# Altium project PowerModule.PrjPCB
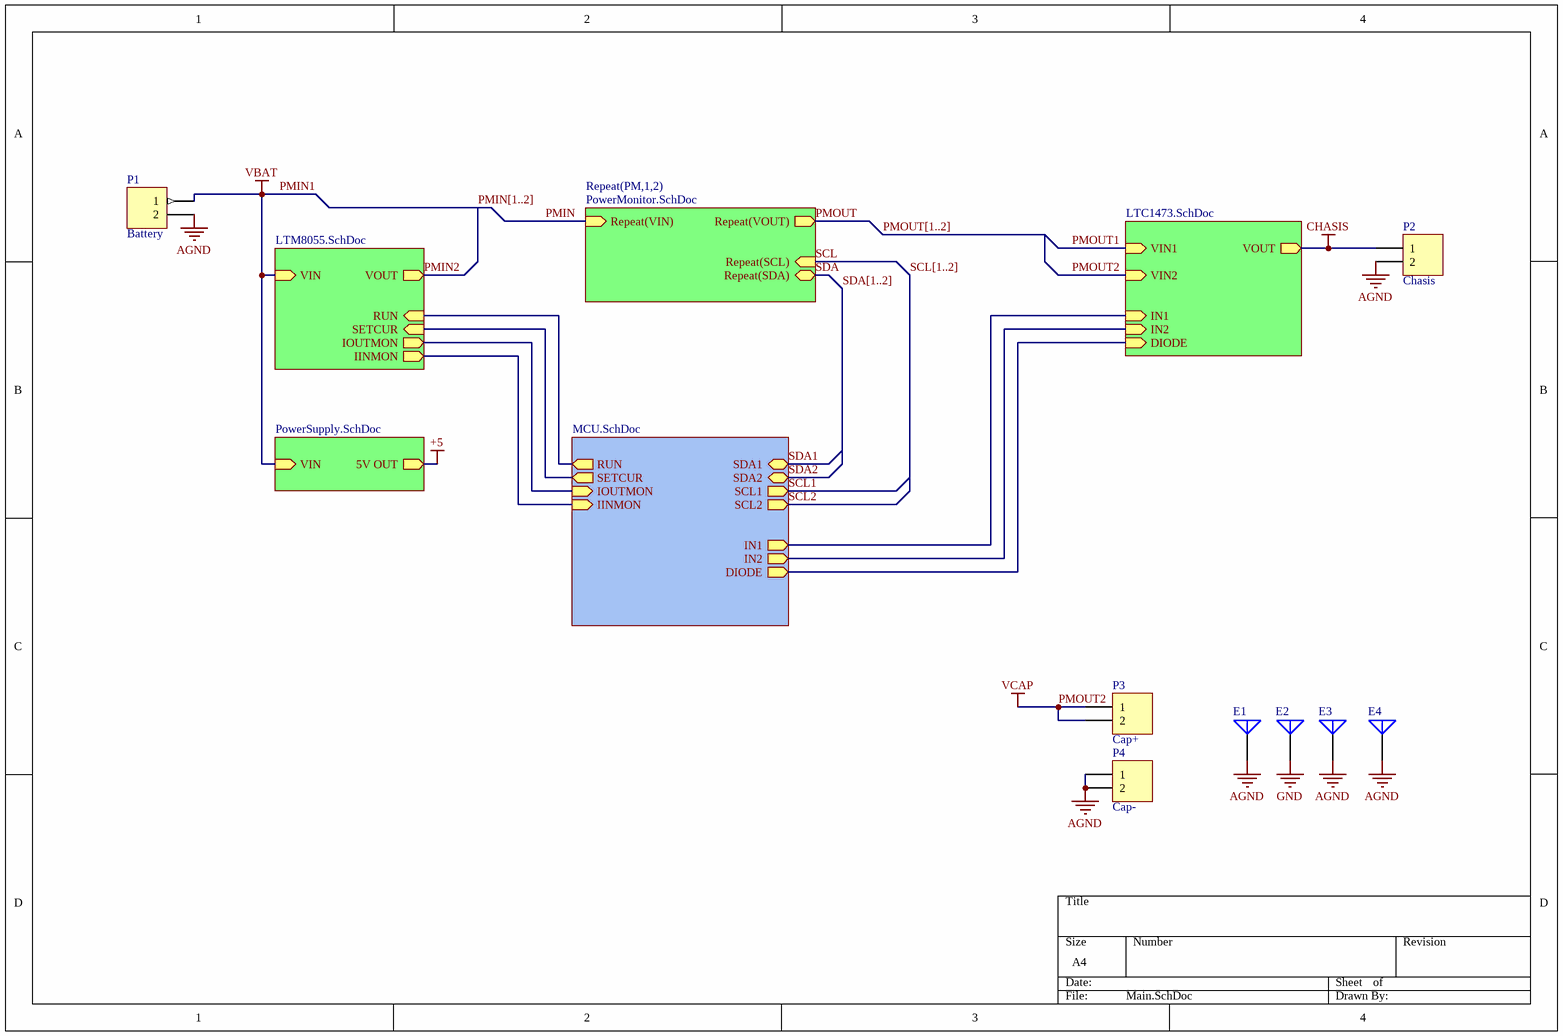
[diagram p0: Main.SchDoc]
6 sheets, 111 parts. Net scope: hierarchical (ports join the sheet entries above them; power ports are global).
Board file: SCModule2.PcbDoc
Sheets:
  Main.SchDoc
    LTM8055 = LTM8055.SchDoc
    MCU = MCU.SchDoc
    PowerSupply = PowerSupply.SchDoc
    LTC1473 = LTC1473.SchDoc
    PM1 = PowerMonitor.SchDoc
    PM2 = PowerMonitor.SchDoc

## Sheet Main.SchDoc
size A4

### Parts
E1  螺丝孔  [M3x4_N]  (value not drawn)
E2  螺丝孔  [M3x4_N]  (value not drawn)
E3  螺丝孔  [M3x4_N]  (value not drawn)
E4  螺丝孔  [M3x4_N]  (value not drawn)
P1  Battery  [TX60PW-M20]
P2  Chasis  [TX60PW-F20]
P3  Cap+  [XT30PW-F]
P4  Cap-  [XT30U-M]

### Sub-sheets
LTC1473 = LTC1473.SchDoc: VIN1 (in), VOUT (out), VIN2 (in), IN2 (in), DIODE (in), IN1 (in)
LTM8055 = LTM8055.SchDoc: VIN (in), VOUT (out), IOUTMON (out), IINMON (out), RUN (in), SETCUR (in)
MCU = MCU.SchDoc: RUN (out), SETCUR (out), IOUTMON (in), IINMON (in), SDA1 (bidir), SDA2 (bidir), SCL1 (out), SCL2 (out), IN1 (out), IN2 (out), DIODE (out)
PowerSupply = PowerSupply.SchDoc: VIN (in), 5V OUT (out)
Repeat(PM,1,2) = PowerMonitor.SchDoc: Repeat(VIN) (in), Repeat(VOUT) (out), Repeat(SCL) (in), Repeat(SDA) (bidir)

### Nets
AGND: E1.1(A) E3.1(A) E4.1(A) P1.2 P2.2 P4.1 P4.2
CHASIS: P2.1 ; sheet LTC1473/VOUT
GND: E2.1(A)
PMIN1: P1.1 ; sheet LTM8055/VIN, sheet PowerSupply/VIN, sheet LTC1473/VIN1  [also labelled PMOUT1, VBAT]  [project net *VIN]
PMOUT2: P3.1 P3.2 ; sheet LTC1473/VIN2  [also labelled VCAP]
PA3: sheet LTM8055/RUN, sheet MCU/RUN
PA4: sheet LTM8055/SETCUR, sheet MCU/SETCUR
PC1: sheet LTM8055/IOUTMON, sheet MCU/IOUTMON
PC2: sheet LTM8055/IINMON, sheet MCU/IINMON
PC10: sheet MCU/IN1, sheet LTC1473/IN1
PC11: sheet MCU/IN2, sheet LTC1473/IN2
PC12: sheet MCU/DIODE, sheet LTC1473/DIODE
PMIN: sheet Repeat(PM,1,2)/Repeat(VIN)
PMOUT: sheet Repeat(PM,1,2)/Repeat(VOUT)
SCL: sheet Repeat(PM,1,2)/Repeat(SCL)
SCL1: sheet MCU/SCL1, sheet MCU/SCL2  [also labelled SCL2]  [project net PB6]
SDA: sheet Repeat(PM,1,2)/Repeat(SDA)
SDA1: sheet MCU/SDA1, sheet MCU/SDA2  [also labelled SDA2]  [project net PB7]

### Buses and harness runs
bus PMIN[1..2]
bus PMOUT[1..2]
bus SCL[1..2]
bus SDA[1..2]

### Library data of the parts
E1-E4 = Antenna: M3螺丝孔; Published: 24-Mar-1999; LatestRevisionDate: 17-Jul-2002; LatestRevisionNote: Re-released for DXP Platform.; PackageReference: PIN1; Publisher: Altium Limited
P1-P4 = Header 2: XT电源接口; LatestRevisionDate: 17-Jul-2002; LatestRevisionNote: Re-released for DXP Platform.; Publisher: Altium Limited

## Sheet LTM8055.SchDoc
size A4
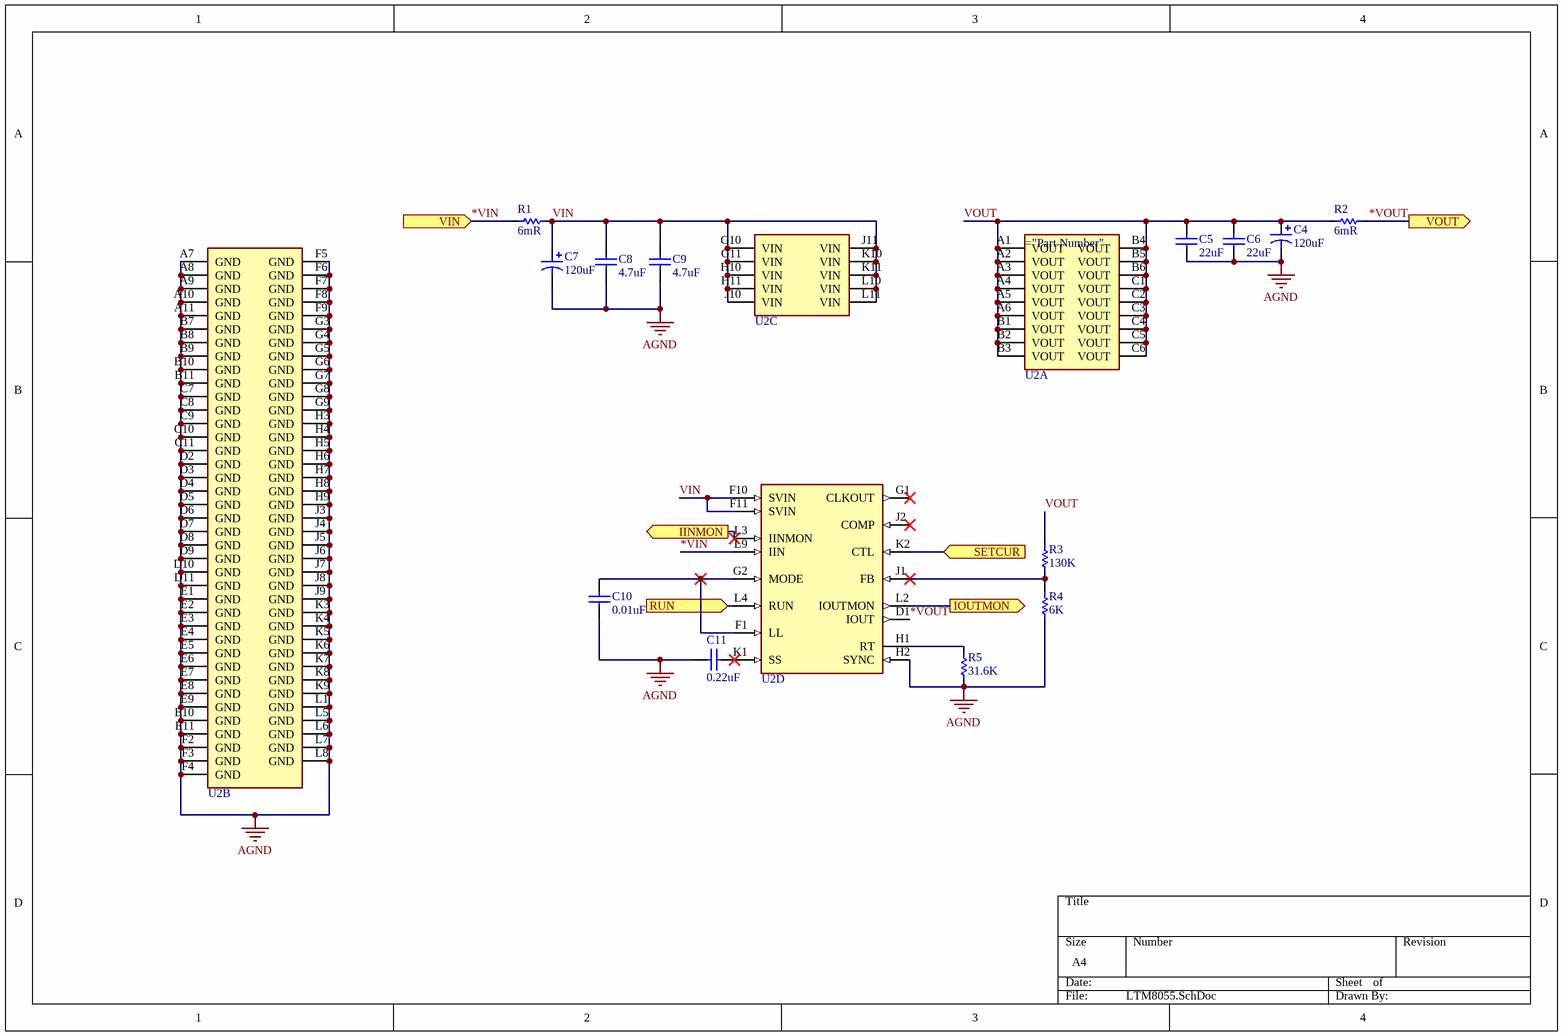
[diagram p1: LTM8055.SchDoc]

### Parts
C4  value 120uF  [CS 5.0*10*13 - C]  (hidden comment: Cap Pol1)
C5  value 22uF  [1210C]  (hidden comment: Cap)
C6  value 22uF  [1210C]  (hidden comment: Cap)
C7  value 120uF  [CS 5.0*10*13 - C]  (hidden comment: Cap Pol1)
C8  value 4.7uF  [1206C]  (hidden comment: Cap)
C9  value 4.7uF  [1206C]  (hidden comment: Cap)
C10  value 0.01uF  [0603C]  (hidden comment: Cap)
C11  value 0.22uF  [0603C]  (hidden comment: Cap)
R1  value 6mR  [R 2512_L]  (hidden comment: Res1)
R2  value 6mR  [R 2512_L]  (hidden comment: Res1)
R3  value 130K  [R 0603_L]  (hidden comment: Res1)
R4  value 6K  [R 0603_L]  (hidden comment: Res1)
R5  value 31.6K  [R 0603_L]  (hidden comment: Res1)
U2  LTM8055MPY#PBF  [DWG# 05-08-1891]  (value not drawn)  (parts A,B,C,D of 4)

### Ports
IINMON (out), IOUTMON (out), RUN (in), SETCUR (in), VIN (in), VOUT (out)

### Nets
*VIN: R1.2 U2.L9(IIN) ; port VIN
AGND: C4.2 C5.1 C6.1 C7.2 C8.1 C9.1 C10.1 C11.2 R4.2 R5.2 U2.A7(GND) U2.A8(GND) U2.A9(GND) U2.A10(GND) U2.A11(GND) U2.B7(GND) U2.B8(GND) U2.B9(GND) U2.B10(GND) U2.B11(GND) U2.C7(GND) U2.C8(GND) U2.C9(GND) U2.C10(GND) U2.C11(GND) U2.D2(GND) U2.D3(GND) U2.D4(GND) U2.D5(GND) U2.D6(GND) U2.D7(GND) U2.D8(GND) U2.D9(GND) U2.D10(GND) U2.D11(GND) U2.E1(GND) U2.E2(GND) U2.E3(GND) U2.E4(GND) U2.E5(GND) U2.E6(GND) U2.E7(GND) U2.E8(GND) U2.E9(GND) U2.E10(GND) U2.E11(GND) U2.F2(GND) U2.F3(GND) U2.F4(GND) U2.F5(GND) U2.F6(GND) U2.F7(GND) U2.F8(GND) U2.F9(GND) U2.G3(GND) U2.G4(GND) U2.G5(GND) U2.G6(GND) U2.G7(GND) U2.G8(GND) U2.G9(GND) U2.H2(SYNC) U2.H3(GND) U2.H4(GND) U2.H5(GND) U2.H6(GND) U2.H7(GND) U2.H8(GND) U2.H9(GND) U2.J3(GND) U2.J4(GND) U2.J5(GND) U2.J6(GND) U2.J7(GND) U2.J8(GND) U2.J9(GND) U2.K3(GND) U2.K4(GND) U2.K5(GND) U2.K6(GND) U2.K7(GND) U2.K8(GND) U2.K9(GND) U2.L1(GND) U2.L5(GND) U2.L6(GND) U2.L7(GND) U2.L8(GND)
*VOUT: R2.1 U2.D1(IOUT) ; port VOUT
PA3: U2.L4(RUN) ; port RUN
PA4: U2.K2(CTL) ; port SETCUR
PC1: U2.L2(IOUTMON) ; port IOUTMON
PC2: U2.L3(IINMON) ; port IINMON
VIN: C7.1 C8.2 C9.2 R1.1 U2.F10(SVIN) U2.F11(SVIN) U2.G10(VIN) U2.G11(VIN) U2.H10(VIN) U2.H11(VIN) U2.J10(VIN) U2.J11(VIN) U2.K10(VIN) U2.K11(VIN) U2.L10(VIN) U2.L11(VIN)
VOUT: C4.1 C5.2 C6.2 R2.2 R3.1 U2.A1(VOUT) U2.A2(VOUT) U2.A3(VOUT) U2.A4(VOUT) U2.A5(VOUT) U2.A6(VOUT) U2.B1(VOUT) U2.B2(VOUT) U2.B3(VOUT) U2.B4(VOUT) U2.B5(VOUT) U2.B6(VOUT) U2.C1(VOUT) U2.C2(VOUT) U2.C3(VOUT) U2.C4(VOUT) U2.C5(VOUT) U2.C6(VOUT)
NetC10_2: C10.2 U2.F1(LL) U2.G2(MODE)
NetC11_1: C11.1 U2.K1(SS)
NetR3_2: R3.2 R4.1 U2.J1(FB)
NetR5_1: R5.1 U2.H1(RT)

Not connected (* = marked no-connect by the designer): U2 G1(CLKOUT)* J2(COMP)*

### Library data of the parts
C4 C7 = Cap Pol1: Polarized Capacitor (Radial); Published: 8-Jun-2000; LatestRevisionDate: 17-Jul-2002; LatestRevisionNote: Re-released for DXP Platform.; PackageReference: RB7.6-15; Publisher: Altium Limited; PackageDescription: Polarized Capacitor (Radial); 2 Leads
C5 C6 C8-C11 = Cap: X5R 50V; Published: 8-Jun-2000; LatestRevisionDate: 17-Jul-2002; LatestRevisionNote: Re-released for DXP Platform.; PackageReference: RAD-0.3; Publisher: Altium Limited; PackageDescription: Radial Cap, Thru-Hole; 2 Leads; 0.3 in Pin Spacing
R1-R5 = Res1: Resistor; Published: 8-Jun-2000; LatestRevisionDate: 17-Jul-2002; LatestRevisionNote: Re-released for DXP Platform.; PackageReference: AXIAL-0.3; Publisher: Altium Limited; PackageDescription: Axial Device, Thru-Hole; 2 Leads; 0.3 in Pin Spacing

## Sheet MCU.SchDoc
size A4
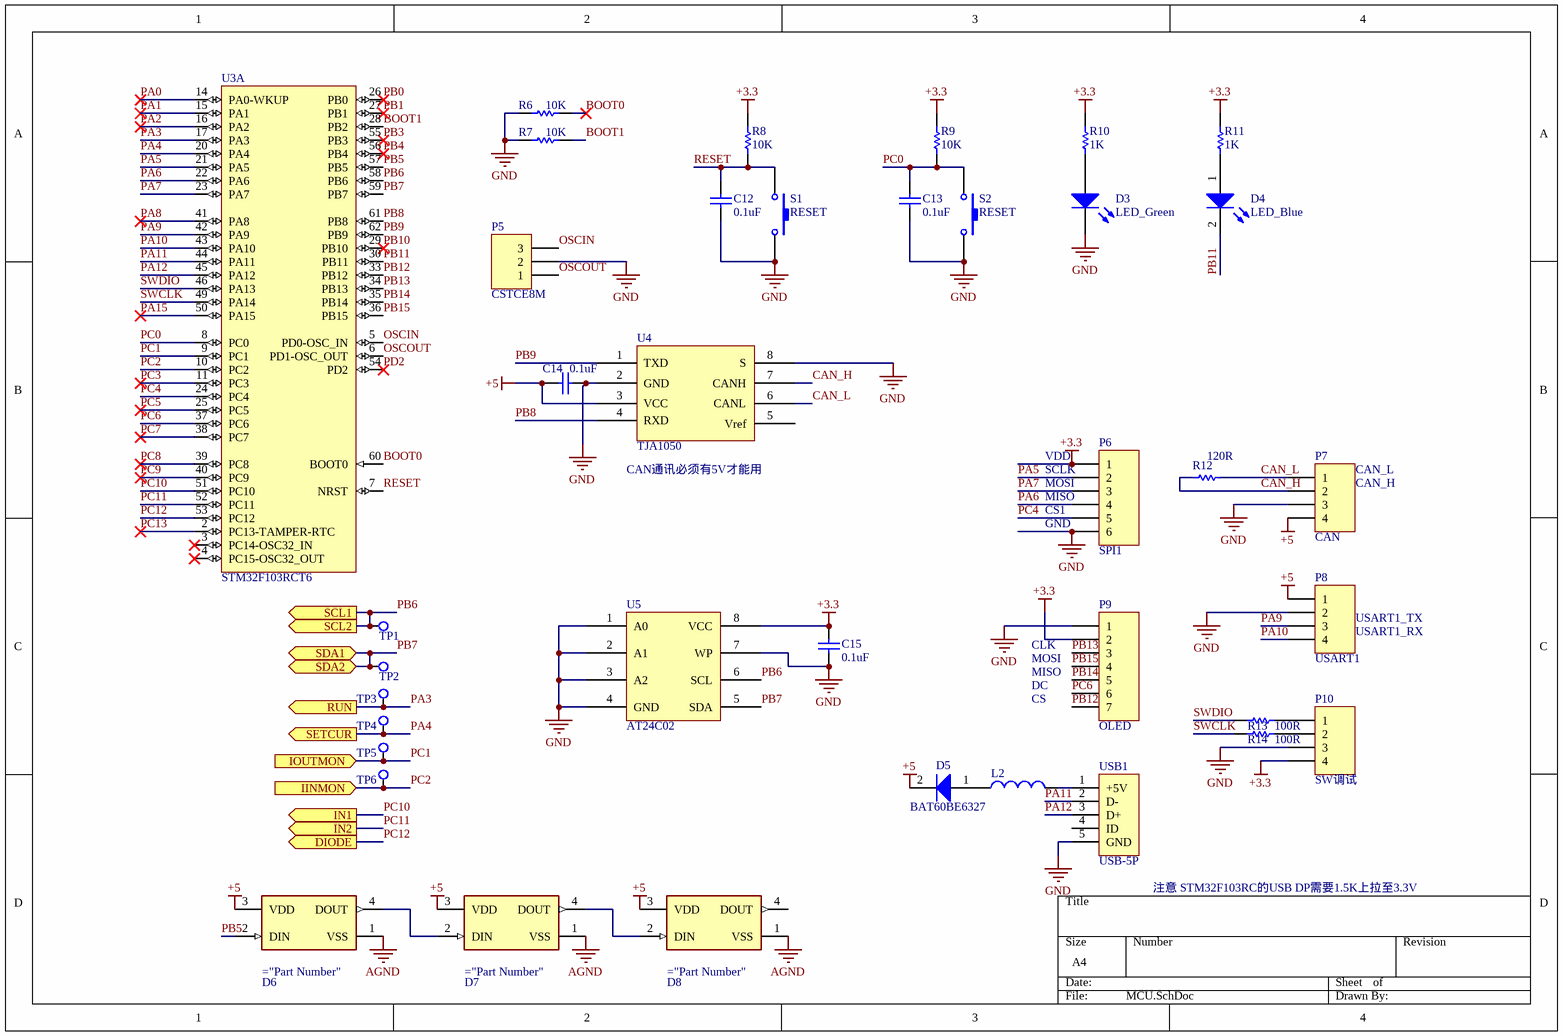
[diagram p2: MCU.SchDoc]

### Parts
C12  value 0.1uF  [0603C]  (hidden comment: Cap)
C13  value 0.1uF  [0603C]  (hidden comment: Cap)
C14  value 0.1uF  [0603C]  (hidden comment: Cap)
C15  value 0.1uF  [0603C]  (hidden comment: Cap)
D3  LED_Green  [LED 0603B]
D4  LED_Blue  [LED 0603B]
D5  BAT60BE6327  [SOD-523]
D6  WS2812  [Adafruit_1655_0]  (value not drawn)
D7  WS2812  [Adafruit_1655_0]  (value not drawn)
D8  WS2812  [Adafruit_1655_0]  (value not drawn)
L2  Inductor  [L 0603]  (value not drawn)
P5  CSTCE8M  [CSTCE16M]
P6  SPI1  [MX 1.25-WS-6P]
P7  CAN  [SM04B]
P8  USART1  [SM04B]
P9  OLED  [HDR2.54-M-LI-7P]
P10  SW调试  [53261]
R6  value 10K  [0603R]  (hidden comment: Res1)
R7  value 10K  [0603R]  (hidden comment: Res1)
R8  value 10K  [0603R]  (hidden comment: Res1)
R9  value 10K  [0603R]  (hidden comment: Res1)
R10  value 1K  [0603R]  (hidden comment: Res1)
R11  value 1K  [0603R]  (hidden comment: Res1)
R12  value 120R  [0603R]  (hidden comment: Res1)
R13  value 100R  [0603R]  (hidden comment: Res1)
R14  value 100R  [0603R]  (hidden comment: Res1)
S1  RESET  [TSW SMD-3*6*2.5]
S2  RESET  [TSW SMD-3*6*2.5]
TP1  TestPoint  [TP_Black(1.6mm)]  (value not drawn)
TP2  TestPoint  [TP_Black(1.6mm)]  (value not drawn)
TP3  TestPoint  [TP_Black(1.6mm)]  (value not drawn)
TP4  TestPoint  [TP_Black(1.6mm)]  (value not drawn)
TP5  TestPoint  [TP_Black(1.6mm)]  (value not drawn)
TP6  TestPoint  [TP_Black(1.6mm)]  (value not drawn)
U3  STM32F103RCT6  [STM-LQFP64_N]  (part A of 2)
U4  TJA1050  [SO8]
U5  AT24C02  [SOP8]
USB1  USB-5P  [USB-MICRO_E]

### Ports
DIODE (out), IINMON (in), IN1 (out), IN2 (out), IOUTMON (in), RUN (out), SCL1 (out), SCL2 (out), SDA1 (bidir), SDA2 (bidir), SETCUR (out)

### Nets
+3.3: C15.1 P6.1 P9.2 P10.4 R8.2 R9.2 R10.2 R11.2 U5.8(VCC)
+5: C14.2 D5.2(K) D6.3(VDD) D7.3(VDD) D8.3(VDD) P7.4 P8.1 U4.3(VCC)
AGND: D6.1(VSS) D7.1(VSS) D8.1(VSS)
GND: C12.1 C13.1 C14.1 C15.2 D3.2(K) P5.2 P6.6 P7.3 P8.2 P9.1 P10.3 R6.1 R7.1 S1.2 S2.2 U4.2(GND) U4.8(S) U5.1(A0) U5.2(A1) U5.3(A2) U5.4(GND) U5.7(WP) USB1.5(GND)
BOOT0: R6.2 U3.60(BOOT0)
BOOT1: R7.2 U3.28(PB2)
CAN_H: P7.2 R12.1 U4.7(CANH)
CAN_L: P7.1 R12.2 U4.6(CANL)
OSCIN: P5.3 U3.5(PD0-OSC_IN)
OSCOUT: P5.1 U3.6(PD1-OSC_OUT)
PA0: U3.14(PA0-WKUP)
PA1: U3.15(PA1)
PA2: U3.16(PA2)
PA3: TP3.1(VSS) U3.17(PA3) ; port RUN
PA4: TP4.1(VSS) U3.20(PA4) ; port SETCUR
PA5: P6.2 U3.21(PA5)
PA6: P6.4 U3.22(PA6)
PA7: P6.3 U3.23(PA7)
PA8: U3.41(PA8)
PA9: P8.3 U3.42(PA9)
PA10: P8.4 U3.43(PA10)
PA11: U3.44(PA11) USB1.2(D-)
PA12: U3.45(PA12) USB1.3(D+)
PA15: U3.50(PA15)
PB0: U3.26(PB0)
PB1: U3.27(PB1)
PB3: U3.55(PB3)
PB4: U3.56(PB4)
PB5: D6.2(DIN) U3.57(PB5)
PB6: TP1.1(VSS) U3.58(PB6) U5.6(SCL) ; port SCL2, port SCL1
PB7: TP2.1(VSS) U3.59(PB7) U5.5(SDA) ; port SDA1, port SDA2
PB8: U3.61(PB8) U4.4(RXD)
PB9: U3.62(PB9) U4.1(TXD)
PB10: U3.29(PB10)
PB11: D4.2(K) U3.30(PB11)
PB12: P9.7 U3.33(PB12)
PB13: P9.3 U3.34(PB13)
PB14: P9.5 U3.35(PB14)
PB15: P9.4 U3.36(PB15)
PC0: C13.2 R9.1 S2.1 U3.8(PC0)
PC1: TP5.1(VSS) U3.9(PC1) ; port IOUTMON
PC2: TP6.1(VSS) U3.10(PC2) ; port IINMON
PC3: U3.11(PC3)
PC4: P6.5 U3.24(PC4)
PC5: U3.25(PC5)
PC6: P9.6 U3.37(PC6)
PC7: U3.38(PC7)
PC8: U3.39(PC8)
PC9: U3.40(PC9)
PC10: U3.51(PC10) ; port IN1
PC11: U3.52(PC11) ; port IN2
PC12: U3.53(PC12) ; port DIODE
PC13: U3.2(PC13-TAMPER-RTC)
PD2: U3.54(PD2)
RESET: C12.2 R8.1 S1.1 U3.7(NRST)
SWCLK: R14.1 U3.49(PA14)
SWDIO: R13.1 U3.46(PA13)
NetD3_1: D3.1(A) R10.1
NetD4_1: D4.1(A) R11.1
NetD5_1: D5.1(A) L2.1
NetD6_4: D6.4(DOUT) D7.2(DIN)
NetD7_4: D7.4(DOUT) D8.2(DIN)
NetL2_2: L2.2 USB1.1(+5V)
NetP10_1: P10.1 R13.2
NetP10_2: P10.2 R14.2

Not connected (* = marked no-connect by the designer): D8 4(DOUT); U3 3(PC14-OSC32_IN)* 4(PC15-OSC32_OUT)*; U4 5(Vref); USB1 4(ID)

### Notes on the sheet
- (near U4) CAN通讯必须有5V才能用
- (near P6) VDD
- (near P6) SCLK
- (near P6) MOSI
- (near P6) MISO
- (near P6) CS1
- (near P7) CAN_L
- (near P7) CAN_H
- (near P6) GND
- (near P9) CLK
- (near P8) USART1_TX
- (near P8) USART1_RX
- CS
- DC
- (near P9) MISO
- (near P9) MOSI
- 注意 STM32F103RC的USB DP需要1.5K上拉至3.3V

### Library data of the parts
C12-C15 = Cap: X5R 50V; Published: 8-Jun-2000; LatestRevisionDate: 17-Jul-2002; LatestRevisionNote: Re-released for DXP Platform.; PackageReference: RAD-0.3; Publisher: Altium Limited; PackageDescription: Radial Cap, Thru-Hole; 2 Leads; 0.3 in Pin Spacing
D3 = LED0: Green; Published: 8-Jun-2000; LatestRevisionDate: 08-Jul-2005; LatestRevisionNote: Mech Layer 1 removed.; PackageReference: LED-0; Publisher: Altium Limited; PackageDescription: LED; 2 Leads
D4 = LED0: Blue; Published: 8-Jun-2000; LatestRevisionDate: 08-Jul-2005; LatestRevisionNote: Mech Layer 1 removed.; PackageReference: LED-0; Publisher: Altium Limited; PackageDescription: LED; 2 Leads
D5 = Diode: Published: 8-Jun-2000; LatestRevisionDate: 17-Jul-2002; LatestRevisionNote: Re-released for DXP Platform.; PackageVersion: Sep-1996; PackageReference: SMC; Publisher: Altium Limited; PackageDescription: DO-214-AB/SMC; 2 C-Bend Leads; Body 7.9 x 5.9 mm, inc. leads (LxW); Code_JEDEC: DO-214-AB
D6-D8 = WS2812: RGB LED
L2 = Inductor: MPZ1608S181ATAH0; Code_IEC: 1005; Value: mH; Published: 8-Jun-2000; LatestRevisionDate: 29-May-2009; LatestRevisionNote: IPC-7351 Footprint Added.; PackageReference: 0402-A; Publisher: Altium Limited; PackageDescription: Chip Inductor; Code_JEITA: 0402
P5 = Header 3: Header, 3-Pin; LatestRevisionDate: 17-Jul-2002; LatestRevisionNote: Re-released for DXP Platform.; Publisher: Altium Limited
P6 = Header 6: Header, 6-Pin; LatestRevisionDate: 17-Jul-2002; LatestRevisionNote: Re-released for DXP Platform.; Publisher: Altium Limited
P7 P8 = Header 4: Header, 4-Pin; LatestRevisionDate: 17-Jul-2002; LatestRevisionNote: Re-released for DXP Platform.; Publisher: Altium Limited
P9 = Header 7: OLED Connector 7P杜邦母头; LatestRevisionDate: 17-Jul-2002; LatestRevisionNote: Re-released for DXP Platform.; Publisher: Altium Limited
P10 = Header 4: Connector MX1.25 4P; LatestRevisionDate: 17-Jul-2002; LatestRevisionNote: Re-released for DXP Platform.; Publisher: Altium Limited
R6-R14 = Res1: Resistor; Published: 8-Jun-2000; LatestRevisionDate: 17-Jul-2002; LatestRevisionNote: Re-released for DXP Platform.; PackageReference: AXIAL-0.3; Publisher: Altium Limited; PackageDescription: Axial Device, Thru-Hole; 2 Leads; 0.3 in Pin Spacing
S1 S2 = SW-PB: Switch; Published: 24-Mar-1999; LatestRevisionDate: 17-Jul-2002; LatestRevisionNote: Re-released for DXP Platform.; PackageReference: SPST-2; Publisher: Altium Limited; PackageDescription: Switch; 2 Leads
TP1-TP6 = TestPoint: PCB测试点
U3 = STM32F103RCT6: ARM Cortex-M3 32-bit MCU, 256 KB Flash, 48 KB Internal RAM, 51 I/Os, 64-pin LQFP, -40 to 85 degC, Tray; A/D Converter: 3x12-bit (16 Channel); D/A Converter: 2x12-bit (2 Channel); FLASH Size (Prog) (kB): 256; I/Os (High Current): 51; Internal RAM Size (kB): 48; Operating Frequency(F) (Processor speed) (MHz): 72; Supply Voltage(Vcc) min (V): 2; DatasheetVersion: Rev. 8; PackageVersion: Rev. 4, 06/2013; PackageReference: LQFP64; PackageDescription: 64-Pin Low Profile Quad Flat Package, 10 x 10 mm Body, 0.5 mm Pitch; Supplier 1: Digi-Key; Supplier Part Number 1: 497-9033-ND; Supplier 2: Newark; Supplier Part Number 2: 01P4099; Supplier 3: Newark; Supplier Part Number 3: 57P1227; Supplier 4: Mouser; Supplier Part Number 4: 511-STM32F103RCT6; Core: ARM Cortex-M3; Packing: Tray; Mounting Technology: Surface Mount; PartNumber: STM32F103RCT6; ComponentLink1Description: Manufacturer URL; ComponentLink1URL: http://www.st.com/web/en/home.html; ComponentLink2Description: Datasheet; ComponentLink2URL: http://www.st.com/st-web-ui/static/active/en/resource/technical/document/datasheet/CD00191185.pdf; ComponentLink3Description: Package Specification; ComponentLink3URL: http://www.st.com/st-web-ui/static/active/en/resource/technical/document/datasheet/DM00037051.pdf
U4 = TJA1050: CAN收发器
USB1 = USB-5P: 微型USB母座; 版权归属: 源创客; BOM名称: 微型USB母座; 学习资源: www.ooocke.com

## Sheet PowerSupply.SchDoc
size A4
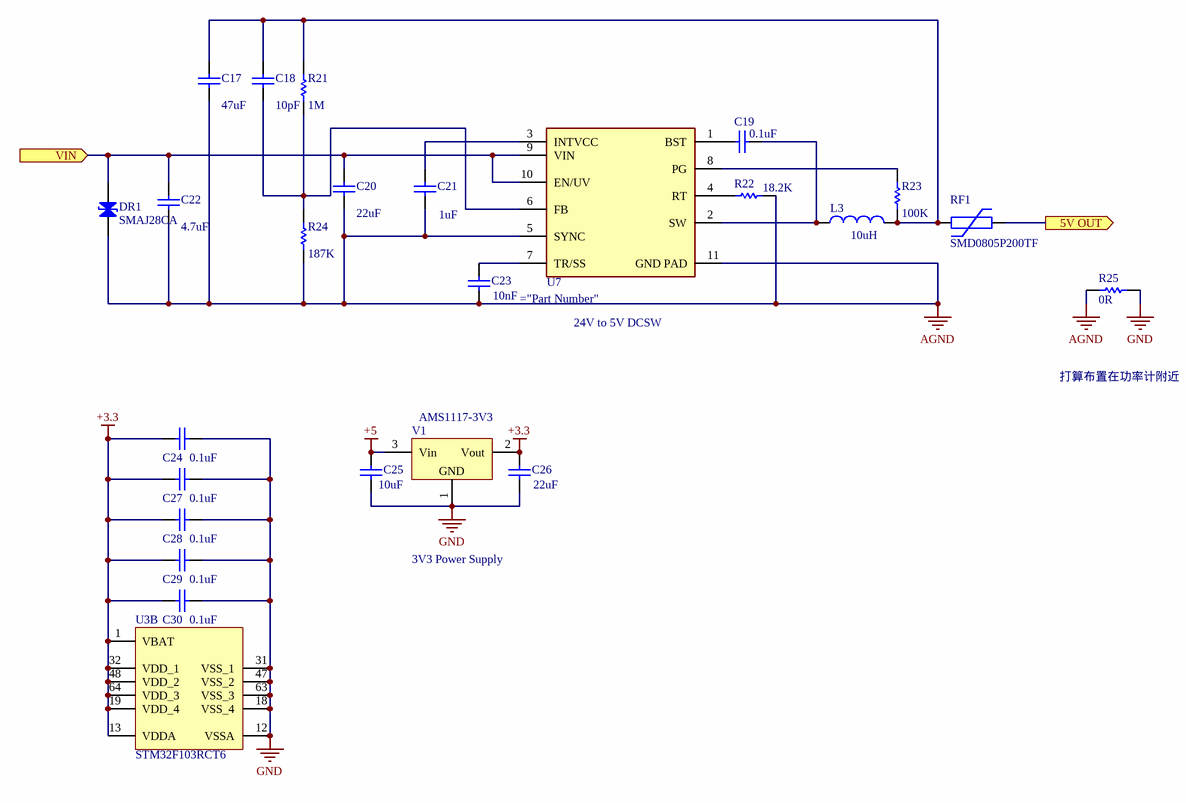
[diagram p3: PowerSupply.SchDoc]

### Parts
C17  value 47uF  [C1206]  (hidden comment: Cap)
C18  value 10pF  [C 0603_L]  (hidden comment: Cap)
C19  value 0.1uF  [C 0603_L]  (hidden comment: Cap)
C20  value 22uF  [C 1206_L]  (hidden comment: Cap)
C21  value 1uF  [C 0603_L]  (hidden comment: Cap)
C22  value 4.7uF  [C 1206_L]  (hidden comment: Cap)
C23  value 10nF  [C 0603_L]  (hidden comment: Cap)
C24  value 0.1uF  [0603C]  (hidden comment: Cap)
C25  value 10uF  [C 1206_L]  (hidden comment: Cap)
C26  value 22uF  [C 1206_L]  (hidden comment: Cap)
C27  value 0.1uF  [0603C]  (hidden comment: Cap)
C28  value 0.1uF  [0603C]  (hidden comment: Cap)
C29  value 0.1uF  [0603C]  (hidden comment: Cap)
C30  value 0.1uF  [0603C]  (hidden comment: Cap)
DR1  SMAJ28CA  [SMA]
L3  value 10uH  [XAL4040]  (hidden comment: Inductor)
R21  value 1M  [R 0603_L]  (hidden comment: Res1)
R22  value 18.2K  [R 0603_L]  (hidden comment: Res1)
R23  value 100K  [R 0603_L]  (hidden comment: Res1)
R24  value 187K  [R 0603_L]  (hidden comment: Res1)
R25  value 0R  [0805R]  (hidden comment: Res1)
RF1  SMD0805P200TF  [R 0805_L]
U3  STM32F103RCT6  [STM-LQFP64_N]  (part B of 2)
U7  LT8609EMSE#PBF  [LT8609EMS]  (value not drawn)
V1  AMS1117-3V3  [SOT223_N]

### Ports
5V OUT (out), VIN (in)

### Nets
*VIN: C20.2 C22.2 DR1.1(A) U7.9(VIN) U7.10(EN/UV) ; port VIN
+3.3: C24.1 C26.2 C27.1 C28.1 C29.1 C30.1 U3.1(VBAT) U3.13(VDDA) U3.19(VDD_4) U3.32(VDD_1) U3.48(VDD_2) U3.64(VDD_3) V1.2(Vout)
+5: C25.2 RF1.2 V1.3(Vin) ; port 5V OUT
AGND: C17.1 C20.1 C21.1 C22.1 C23.1 DR1.2(K) R22.1 R24.2 R25.2 U7.5(SYNC) U7.11(GND_PAD)
GND: C24.2 C25.1 C26.1 C27.2 C28.2 C29.2 C30.2 R25.1 U3.12(VSSA) U3.18(VSS_4) U3.31(VSS_1) U3.47(VSS_2) U3.63(VSS_3) V1.1(GND)
NetC17_2: C17.2 C18.2 L3.2 R21.1 R23.1 RF1.1
NetC18_1: C18.1 R21.2 R24.1 U7.6(FB)
NetC19_1: C19.1 L3.1 U7.2(SW)
NetC19_2: C19.2 U7.1(BST)
NetC21_2: C21.2 U7.3(INTVCC)
NetC23_2: C23.2 U7.7(TR/SS)
NetR22_2: R22.2 U7.4(RT)
NetR23_2: R23.2 U7.8(PG)

### Notes on the sheet
- 24V to 5V DCSW
- 打算布置在功率计附近
- 3V3 Power Supply

### Library data of the parts
C17 C25 C26 = Cap: X5R 25V; Published: 8-Jun-2000; LatestRevisionDate: 17-Jul-2002; LatestRevisionNote: Re-released for DXP Platform.; PackageReference: RAD-0.3; Publisher: Altium Limited; PackageDescription: Radial Cap, Thru-Hole; 2 Leads; 0.3 in Pin Spacing
C18 C23 = Cap: C0G 50V; Published: 8-Jun-2000; LatestRevisionDate: 17-Jul-2002; LatestRevisionNote: Re-released for DXP Platform.; PackageReference: RAD-0.3; Publisher: Altium Limited; PackageDescription: Radial Cap, Thru-Hole; 2 Leads; 0.3 in Pin Spacing
C19-C22 C24 C27-C30 = Cap: X5R 50V; Published: 8-Jun-2000; LatestRevisionDate: 17-Jul-2002; LatestRevisionNote: Re-released for DXP Platform.; PackageReference: RAD-0.3; Publisher: Altium Limited; PackageDescription: Radial Cap, Thru-Hole; 2 Leads; 0.3 in Pin Spacing
DR1 = DR: 瞬态电压抑制二极管; 版权归属: 源创客; BOM名称: 瞬态电压抑制二极管; 学习资源: www.ooocke.com
L3 = Inductor: XAL4040 10uH; Code_IEC: 1005; Published: 8-Jun-2000; LatestRevisionDate: 29-May-2009; LatestRevisionNote: IPC-7351 Footprint Added.; PackageReference: 0402-A; Publisher: Altium Limited; PackageDescription: Chip Inductor; Code_JEITA: 0402
R21-R25 = Res1: Resistor; Published: 8-Jun-2000; LatestRevisionDate: 17-Jul-2002; LatestRevisionNote: Re-released for DXP Platform.; PackageReference: AXIAL-0.3; Publisher: Altium Limited; PackageDescription: Axial Device, Thru-Hole; 2 Leads; 0.3 in Pin Spacing
RF1 = PPTC: PPTC自恢复保险丝; 版权归属: 源创客; BOM名称: PPTC自恢复保险丝; 学习资源: www.ooocke.com
U3 = STM32F103RCT6: as U3 on sheet MCU; DatasheetVersion: Rev. 8; PackageVersion: Rev. 4, 06/2013; PackageReference: LQFP64; PackageDescription: 64-Pin Low Profile Quad Flat Package, 10 x 10 mm Body, 0.5 mm Pitch; Supplier 1: Digi-Key; Supplier Part Number 1: 497-9033-ND; Supplier 2: Newark; Supplier Part Number 2: 01P4099; Supplier 3: Newark; Supplier Part Number 3: 57P1227; Supplier 4: Mouser; Supplier Part Number 4: 511-STM32F103RCT6; Core: ARM Cortex-M3; Packing: Tray; Mounting Technology: Surface Mount; PartNumber: STM32F103RCT6; ComponentLink1Description: Manufacturer URL; ComponentLink1URL: http://www.st.com/web/en/home.html; ComponentLink2Description: Datasheet; ComponentLink2URL: http://www.st.com/st-web-ui/static/active/en/resource/technical/document/datasheet/CD00191185.pdf; ComponentLink3Description: Package Specification; ComponentLink3URL: http://www.st.com/st-web-ui/static/active/en/resource/technical/document/datasheet/DM00037051.pdf
V1 = AMS1117: 三端稳压芯片; BOM名称: 稳压芯片; 版权归属: 源创客; 学习资源: www.ooocke.com

## Sheet LTC1473.SchDoc
size A4
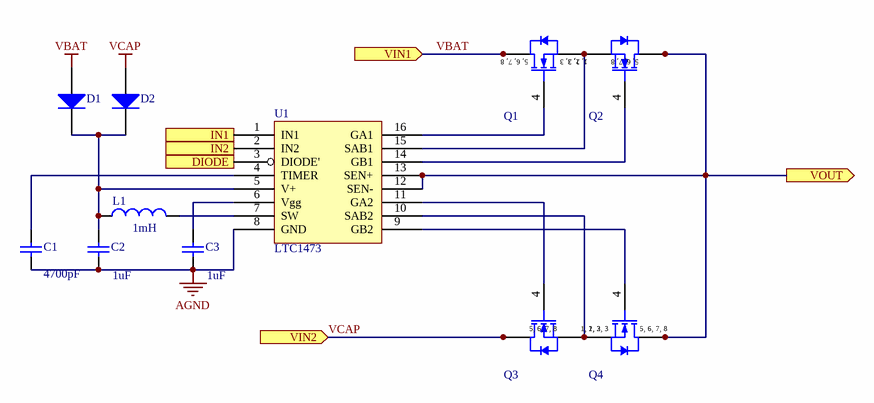
[diagram p4: LTC1473.SchDoc]

### Parts
C1  value 4700pF  [C 0603_L]  (hidden comment: Cap)
C2  value 1uF  [C 0603_L]  (hidden comment: Cap)
C3  value 1uF  [C 0603_L]  (hidden comment: Cap)
D1  Diode  [SOD-523]  (value not drawn)
D2  Diode  [SOD-523]  (value not drawn)
L1  value 1mH  [1812LS-105XKBC]  (hidden comment: Inductor)
Q1  BSC028N06NS G  [INF-PG-TDSON-8-1_V]  (value not drawn)
Q2  BSC028N06NS G  [INF-PG-TDSON-8-1_V]  (value not drawn)
Q3  BSC028N06NS G  [INF-PG-TDSON-8-1_V]  (value not drawn)
Q4  BSC028N06NS G  [INF-PG-TDSON-8-1_V]  (value not drawn)
U1  LTC1473  [SSOP16_N]

### Ports
DIODE (in), IN1 (in), IN2 (in), VIN1 (in), VIN2 (in), VOUT (out)

### Nets
AGND: C1.1 C2.1 C3.1 U1.8(GND)
CHASIS: Q2.5(DRAIN) Q2.6(DRAIN) Q2.7(DRAIN) Q2.8(DRAIN) Q4.5(DRAIN) Q4.6(DRAIN) Q4.7(DRAIN) Q4.8(DRAIN) U1.12(SEN-) U1.13(SEN+) ; port VOUT
VBAT: D1.1(A) Q1.5(DRAIN) Q1.6(DRAIN) Q1.7(DRAIN) Q1.8(DRAIN) ; port VIN1  [project net *VIN]
VCAP: D2.1(A) Q3.5(DRAIN) Q3.6(DRAIN) Q3.7(DRAIN) Q3.8(DRAIN) ; port VIN2  [project net PMOUT2]
PC10: U1.1(IN1) ; port IN1
PC11: U1.2(IN2) ; port IN2
PC12: U1.3(DIODE') ; port DIODE
NetC1_2: C1.2 U1.4(TIMER)
NetC2_2: C2.2 D1.2(K) D2.2(K) L1.1 U1.5(V+)
NetC3_2: C3.2 U1.6(Vgg)
NetL1_2: L1.2 U1.7(SW)
NetQ1_1: Q1.1(SOURCE) Q1.2(SOURCE) Q1.3(SOURCE) Q2.1(SOURCE) Q2.2(SOURCE) Q2.3(SOURCE) U1.15(SAB1)
NetQ1_4: Q1.4(GATE) U1.16(GA1)
NetQ2_4: Q2.4(GATE) U1.14(GB1)
NetQ3_1: Q3.1(SOURCE) Q3.2(SOURCE) Q3.3(SOURCE) Q4.1(SOURCE) Q4.2(SOURCE) Q4.3(SOURCE) U1.10(SAB2)
NetQ3_4: Q3.4(GATE) U1.11(GA2)
NetQ4_4: Q4.4(GATE) U1.9(GB2)

### Notes on the sheet
- (in symbol BSC118N10NS G) 5, 6, 7, 8; 1, 2, 3

### Library data of the parts
C1-C3 = Cap: X5R 50V; Published: 8-Jun-2000; LatestRevisionDate: 17-Jul-2002; LatestRevisionNote: Re-released for DXP Platform.; PackageReference: RAD-0.3; Publisher: Altium Limited; PackageDescription: Radial Cap, Thru-Hole; 2 Leads; 0.3 in Pin Spacing
D1 D2 = Diode: SS14; Published: 8-Jun-2000; LatestRevisionDate: 17-Jul-2002; LatestRevisionNote: Re-released for DXP Platform.; PackageVersion: Sep-1996; PackageReference: SMC; Publisher: Altium Limited; PackageDescription: DO-214-AB/SMC; 2 C-Bend Leads; Body 7.9 x 5.9 mm, inc. leads (LxW); Code_JEDEC: DO-214-AB
L1 = Inductor: 1812LS-105XKBC; Code_IEC: 1005; Published: 8-Jun-2000; LatestRevisionDate: 29-May-2009; LatestRevisionNote: IPC-7351 Footprint Added.; PackageReference: 0402-A; Publisher: Altium Limited; PackageDescription: Chip Inductor; Code_JEITA: 0402
Q1-Q4 = BSC118N10NS G: N-Channel OptiMOS 2 Power-Transistor, 100 V VDS, 71 A ID, -55 to 150 degC , PG-TDSON-8-1, Reel, Green; Manufacturer: Infineon; Green: TRUE; ID (max): 71 A; IDpuls (max): 280 A; Polarity: N; Ptot (max): 114 W; QG: 42 nC; RDS (on) (max): 11.8 mOhm; Rth: 1.1 K/W; RthJA (max): 62 K/W; VDS (max): 100 V; VGS(th) (max): 4 V; VGS(th) (min): 2 V; DatasheetVersion: Rev. 1.08; PackageReference: PG-TDSON-8-1; PackageDescription: 8-Pin Plastic (Green) Thin Dual Small Outline Non-Leaded Package, 5.15 x 5.9 mm Body, 1.27 mm Pitch; Supplier 1: Mouser; Supplier Part Number 1: 726-BSC118N10NSG; Supplier 2: Digi-Key; Supplier Part Number 2: BSC118N10NS G-ND; Halogen-free: TRUE; Packing: Reel; RthJC (max): 1.1 K/W; Mounting Technology: Surface Mount; PartNumber: BSC118N10NS G; ComponentLink1Description: Manufacturer URL; ComponentLink1URL: http://www.infineon.com/; ComponentLink2Description: Datasheet; ComponentLink2URL: http://www.infineon.com/dgdl/BSC118N10NS+Rev18_pdf.pdf?folderId=db3a3043156fd5730115c7d50620107c&fileId=db3a3043163797a6011647fdc2d4071c; ComponentLink3Description: Package Specification; ComponentLink3URL: http://www.infineon.com/cms/packages/SMD_-_Surface_Mounted_Devices/P-PG-TDSON/P-PG-TDSON-08-01x_2x_3.html?__locale=en

## Sheet PowerMonitor.SchDoc
size A4
Used 2 times, as channels PM1, PM2. Parts and nets are listed once, with the designators drawn on the sheet.
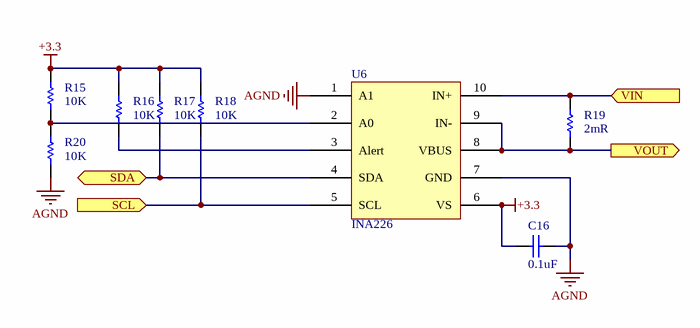
[diagram p5: PowerMonitor.SchDoc]

### Parts
C16  value 0.1uF  [C 0603_L]  (hidden comment: Cap)
R15  value 10K  [R 0603_L]  (hidden comment: Res1)
R16  value 10K  [R 0603_L]  (hidden comment: Res1)
R17  value 10K  [R 0603_L]  (hidden comment: Res1)
R18  value 10K  [R 0603_L]  (hidden comment: Res1)
R19  value 2mR  [R 2512_L]  (hidden comment: Res1)
R20  value 10K  [R 0603_L]  (hidden comment: Res1)
U6  INA226  [MSOP10_N]

### Ports
SCL (in), SDA (bidir), VIN (in), VOUT (out)

### Nets
+3.3: C16.1 R15.2 R16.2 R17.2 R18.2 U6.6(VS)
AGND: C16.2 R20.1 U6.1(A1) U6.7(GND)
SCL: R18.1 U6.5(SCL) ; port SCL
SDA: R17.1 U6.4(SDA) ; port SDA
VIN: R19.2 U6.10(IN+) ; port VIN
VOUT: R19.1 U6.8(VBUS) U6.9(IN-) ; port VOUT
NetR15_1: R15.1 R20.2 U6.2(A0)
NetR16_1: R16.1 U6.3(Alert)

### Channels
PM1: designators end in A; ports SCL=PB6 SDA=PB7 VIN=*VIN VOUT=*VIN
PM2: designators end in B; ports SCL=PB6 SDA=PB7 VIN=*VOUT VOUT=PMOUT2

### Library data of the parts
C16 = Cap: X5R 50V; Published: 8-Jun-2000; LatestRevisionDate: 17-Jul-2002; LatestRevisionNote: Re-released for DXP Platform.; PackageReference: RAD-0.3; Publisher: Altium Limited; PackageDescription: Radial Cap, Thru-Hole; 2 Leads; 0.3 in Pin Spacing
R15-R20 = Res1: Resistor; Published: 8-Jun-2000; LatestRevisionDate: 17-Jul-2002; LatestRevisionNote: Re-released for DXP Platform.; PackageReference: AXIAL-0.3; Publisher: Altium Limited; PackageDescription: Axial Device, Thru-Hole; 2 Leads; 0.3 in Pin Spacing

## Nets that join several sheets
*VIN: Main (P1.1), LTM8055 (R1.2 U2.L9), PowerSupply (5 pins), LTC1473 (5 pins), PM1 (5 pins)
+3.3: MCU (9 pins), PowerSupply (13 pins), PM1 (6 pins), PM2 (6 pins)
+5: MCU (8 pins), PowerSupply (C25.2 RF1.2 V1.3)
AGND: Main (7 pins), LTM8055 (88 pins), MCU (D6.1 D7.1 D8.1), PowerSupply (11 pins), LTC1473 (C1.1 C2.1 C3.1 U1.8), PM1 (C16A.2 R20A.1 U6A.1 U6A.7), PM2 (C16B.2 R20B.1 U6B.1 U6B.7)
CHASIS: Main (P2.1), LTC1473 (10 pins)
GND: Main (E2.1), MCU (23 pins), PowerSupply (14 pins)
PMOUT2: Main (P3.1 P3.2), LTC1473 (5 pins), PM2 (R19B.1 U6B.8 U6B.9)
*VOUT: LTM8055 (R2.1 U2.D1), PM2 (R19B.2 U6B.10)
PA3: LTM8055 (U2.L4), MCU (TP3.1 U3.17)
PA4: LTM8055 (U2.K2), MCU (TP4.1 U3.20)
PB6: MCU (TP1.1 U3.58 U5.6), PM1 (R18A.1 U6A.5), PM2 (R18B.1 U6B.5)
PB7: MCU (TP2.1 U3.59 U5.5), PM1 (R17A.1 U6A.4), PM2 (R17B.1 U6B.4)
PC1: LTM8055 (U2.L2), MCU (TP5.1 U3.9)
PC2: LTM8055 (U2.L3), MCU (TP6.1 U3.10)
PC10: MCU (U3.51), LTC1473 (U1.1)
PC11: MCU (U3.52), LTC1473 (U1.2)
PC12: MCU (U3.53), LTC1473 (U1.3)